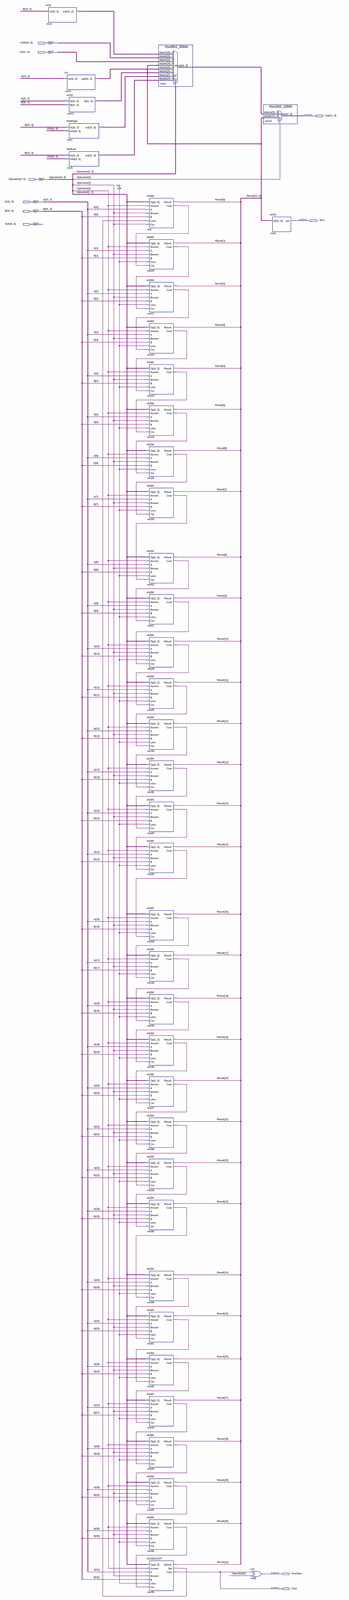
[diagram p0: schematic sheet, whole]
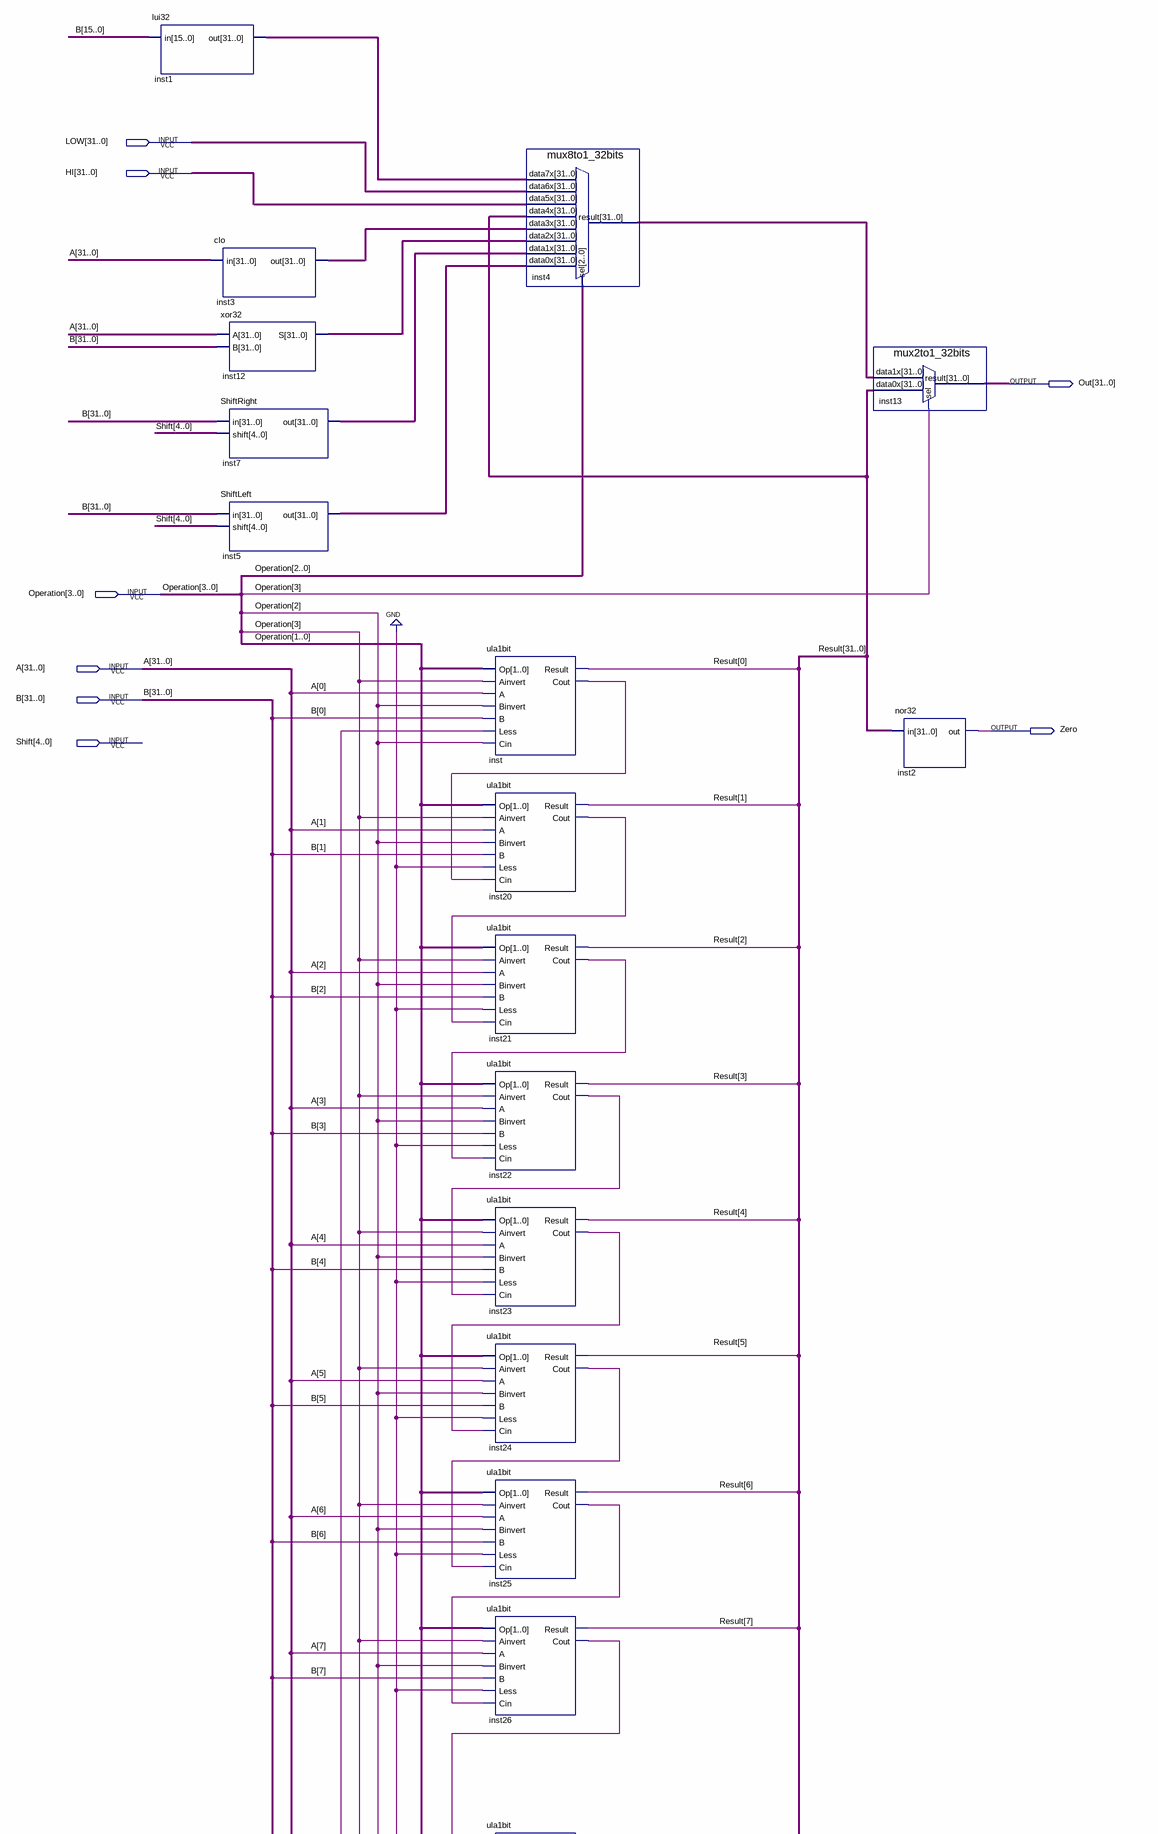
[diagram p1: schematic sheet, upper part]
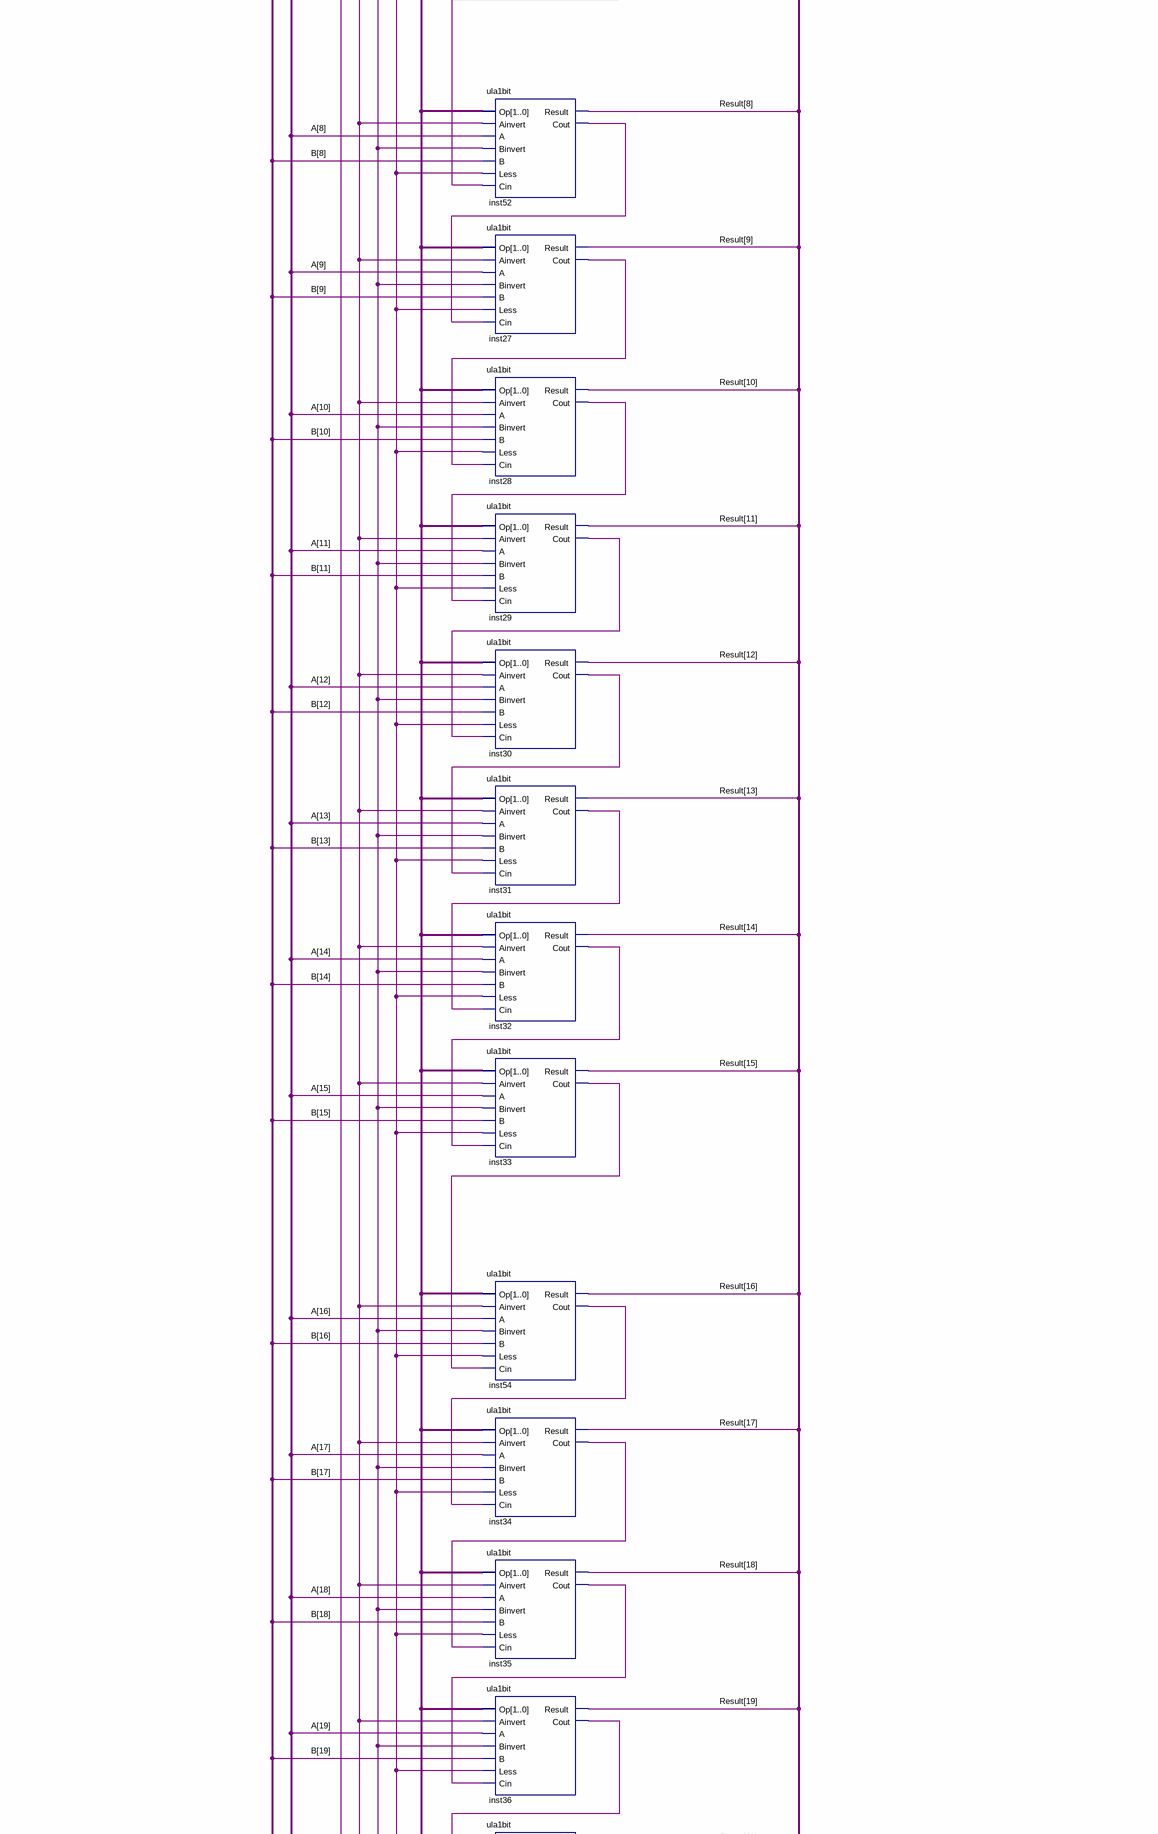
[diagram p2: schematic sheet, middle part]
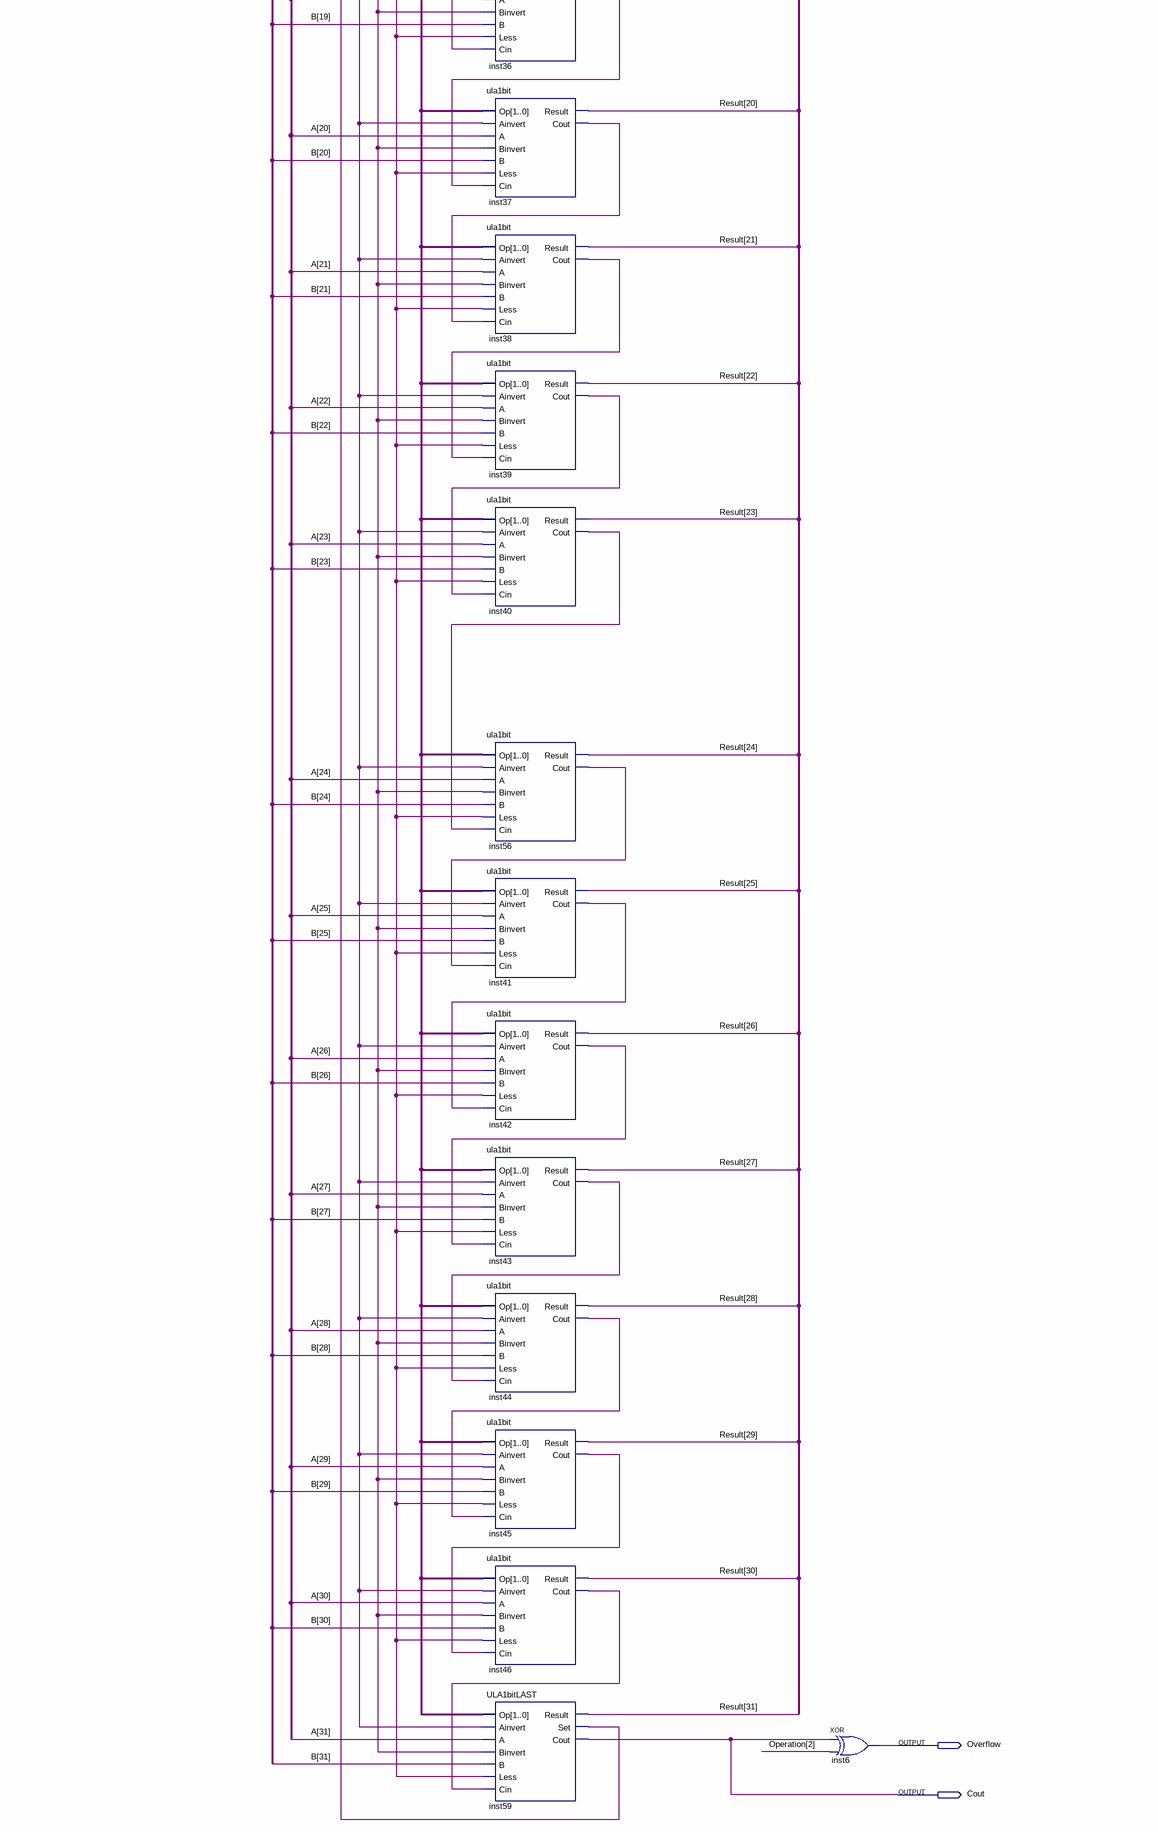
[diagram p3: schematic sheet, lower part]
// Quartus schematic ULA.bdf as structural Verilog: 41 symbols, 10 pins
module ULA (
  input  [31:0] LOW,
  input  [31:0] HI,
  input  [3:0] Operation,
  input  [31:0] A,
  input  [31:0] B,
  input  [4:0] Shift,
  output [31:0] Out,
  output Zero,
  output Overflow,
  output Cout
);

  wire inst20_cout, inst21_cout, inst22_cout, inst23_cout, inst24_cout, inst25_cout, inst26_cout,
       inst27_cout, inst28_cout, inst29_cout, inst30_cout, inst31_cout, inst32_cout, inst33_cout,
       inst34_cout, inst35_cout, inst36_cout, inst37_cout, inst38_cout, inst39_cout, inst40_cout,
       inst41_cout, inst42_cout, inst43_cout, inst44_cout, inst45_cout, inst46_cout, inst52_cout,
       inst54_cout, inst56_cout, inst59_set, inst_cout;
  wire [31:0] inst1_out, inst3_out, inst4_result, inst5_out, inst7_out, inst12_s, Result;

  lui32 inst1 (.in(B[15:0]), .out(inst1_out));
  clo inst3 (.in(A), .out(inst3_out));
  xor32 inst12 (.A(A), .B(B), .S(inst12_s));
  ShiftRight inst7 (.in(B), .shift(Shift), .out(inst7_out));
  ShiftLeft inst5 (.in(B), .shift(Shift), .out(inst5_out));
  ula1bit inst (
    .Op(Operation[1:0]), .Ainvert(Operation[3]), .A(A[0]), .Binvert(Operation[2]), .B(B[0]),
    .Less(inst59_set), .Cin(Operation[2]), .Result(Result[0]), .Cout(inst_cout));
  ula1bit inst20 (
    .Op(Operation[1:0]), .Ainvert(Operation[3]), .A(A[1]), .Binvert(Operation[2]), .B(B[1]), .Less(1'b0),
    .Cin(inst_cout), .Result(Result[1]), .Cout(inst20_cout));
  ula1bit inst21 (
    .Op(Operation[1:0]), .Ainvert(Operation[3]), .A(A[2]), .Binvert(Operation[2]), .B(B[2]), .Less(1'b0),
    .Cin(inst20_cout), .Result(Result[2]), .Cout(inst21_cout));
  ula1bit inst22 (
    .Op(Operation[1:0]), .Ainvert(Operation[3]), .A(A[3]), .Binvert(Operation[2]), .B(B[3]), .Less(1'b0),
    .Cin(inst21_cout), .Result(Result[3]), .Cout(inst22_cout));
  ula1bit inst23 (
    .Op(Operation[1:0]), .Ainvert(Operation[3]), .A(A[4]), .Binvert(Operation[2]), .B(B[4]), .Less(1'b0),
    .Cin(inst22_cout), .Result(Result[4]), .Cout(inst23_cout));
  ula1bit inst24 (
    .Op(Operation[1:0]), .Ainvert(Operation[3]), .A(A[5]), .Binvert(Operation[2]), .B(B[5]), .Less(1'b0),
    .Cin(inst23_cout), .Result(Result[5]), .Cout(inst24_cout));
  ula1bit inst25 (
    .Op(Operation[1:0]), .Ainvert(Operation[3]), .A(A[6]), .Binvert(Operation[2]), .B(B[6]), .Less(1'b0),
    .Cin(inst24_cout), .Result(Result[6]), .Cout(inst25_cout));
  ula1bit inst26 (
    .Op(Operation[1:0]), .Ainvert(Operation[3]), .A(A[7]), .Binvert(Operation[2]), .B(B[7]), .Less(1'b0),
    .Cin(inst25_cout), .Result(Result[7]), .Cout(inst26_cout));
  ula1bit inst52 (
    .Op(Operation[1:0]), .Ainvert(Operation[3]), .A(A[8]), .Binvert(Operation[2]), .B(B[8]), .Less(1'b0),
    .Cin(inst26_cout), .Result(Result[8]), .Cout(inst52_cout));
  ula1bit inst27 (
    .Op(Operation[1:0]), .Ainvert(Operation[3]), .A(A[9]), .Binvert(Operation[2]), .B(B[9]), .Less(1'b0),
    .Cin(inst52_cout), .Result(Result[9]), .Cout(inst27_cout));
  ula1bit inst28 (
    .Op(Operation[1:0]), .Ainvert(Operation[3]), .A(A[10]), .Binvert(Operation[2]), .B(B[10]), .Less(1'b0),
    .Cin(inst27_cout), .Result(Result[10]), .Cout(inst28_cout));
  ula1bit inst29 (
    .Op(Operation[1:0]), .Ainvert(Operation[3]), .A(A[11]), .Binvert(Operation[2]), .B(B[11]), .Less(1'b0),
    .Cin(inst28_cout), .Result(Result[11]), .Cout(inst29_cout));
  ula1bit inst30 (
    .Op(Operation[1:0]), .Ainvert(Operation[3]), .A(A[12]), .Binvert(Operation[2]), .B(B[12]), .Less(1'b0),
    .Cin(inst29_cout), .Result(Result[12]), .Cout(inst30_cout));
  ula1bit inst31 (
    .Op(Operation[1:0]), .Ainvert(Operation[3]), .A(A[13]), .Binvert(Operation[2]), .B(B[13]), .Less(1'b0),
    .Cin(inst30_cout), .Result(Result[13]), .Cout(inst31_cout));
  ula1bit inst32 (
    .Op(Operation[1:0]), .Ainvert(Operation[3]), .A(A[14]), .Binvert(Operation[2]), .B(B[14]), .Less(1'b0),
    .Cin(inst31_cout), .Result(Result[14]), .Cout(inst32_cout));
  ula1bit inst33 (
    .Op(Operation[1:0]), .Ainvert(Operation[3]), .A(A[15]), .Binvert(Operation[2]), .B(B[15]), .Less(1'b0),
    .Cin(inst32_cout), .Result(Result[15]), .Cout(inst33_cout));
  ula1bit inst54 (
    .Op(Operation[1:0]), .Ainvert(Operation[3]), .A(A[16]), .Binvert(Operation[2]), .B(B[16]), .Less(1'b0),
    .Cin(inst33_cout), .Result(Result[16]), .Cout(inst54_cout));
  ula1bit inst34 (
    .Op(Operation[1:0]), .Ainvert(Operation[3]), .A(A[17]), .Binvert(Operation[2]), .B(B[17]), .Less(1'b0),
    .Cin(inst54_cout), .Result(Result[17]), .Cout(inst34_cout));
  ula1bit inst35 (
    .Op(Operation[1:0]), .Ainvert(Operation[3]), .A(A[18]), .Binvert(Operation[2]), .B(B[18]), .Less(1'b0),
    .Cin(inst34_cout), .Result(Result[18]), .Cout(inst35_cout));
  ula1bit inst36 (
    .Op(Operation[1:0]), .Ainvert(Operation[3]), .A(A[19]), .Binvert(Operation[2]), .B(B[19]), .Less(1'b0),
    .Cin(inst35_cout), .Result(Result[19]), .Cout(inst36_cout));
  ula1bit inst37 (
    .Op(Operation[1:0]), .Ainvert(Operation[3]), .A(A[20]), .Binvert(Operation[2]), .B(B[20]), .Less(1'b0),
    .Cin(inst36_cout), .Result(Result[20]), .Cout(inst37_cout));
  ula1bit inst38 (
    .Op(Operation[1:0]), .Ainvert(Operation[3]), .A(A[21]), .Binvert(Operation[2]), .B(B[21]), .Less(1'b0),
    .Cin(inst37_cout), .Result(Result[21]), .Cout(inst38_cout));
  ula1bit inst39 (
    .Op(Operation[1:0]), .Ainvert(Operation[3]), .A(A[22]), .Binvert(Operation[2]), .B(B[22]), .Less(1'b0),
    .Cin(inst38_cout), .Result(Result[22]), .Cout(inst39_cout));
  ula1bit inst40 (
    .Op(Operation[1:0]), .Ainvert(Operation[3]), .A(A[23]), .Binvert(Operation[2]), .B(B[23]), .Less(1'b0),
    .Cin(inst39_cout), .Result(Result[23]), .Cout(inst40_cout));
  ula1bit inst56 (
    .Op(Operation[1:0]), .Ainvert(Operation[3]), .A(A[24]), .Binvert(Operation[2]), .B(B[24]), .Less(1'b0),
    .Cin(inst40_cout), .Result(Result[24]), .Cout(inst56_cout));
  ula1bit inst41 (
    .Op(Operation[1:0]), .Ainvert(Operation[3]), .A(A[25]), .Binvert(Operation[2]), .B(B[25]), .Less(1'b0),
    .Cin(inst56_cout), .Result(Result[25]), .Cout(inst41_cout));
  ula1bit inst42 (
    .Op(Operation[1:0]), .Ainvert(Operation[3]), .A(A[26]), .Binvert(Operation[2]), .B(B[26]), .Less(1'b0),
    .Cin(inst41_cout), .Result(Result[26]), .Cout(inst42_cout));
  ula1bit inst43 (
    .Op(Operation[1:0]), .Ainvert(Operation[3]), .A(A[27]), .Binvert(Operation[2]), .B(B[27]), .Less(1'b0),
    .Cin(inst42_cout), .Result(Result[27]), .Cout(inst43_cout));
  ula1bit inst44 (
    .Op(Operation[1:0]), .Ainvert(Operation[3]), .A(A[28]), .Binvert(Operation[2]), .B(B[28]), .Less(1'b0),
    .Cin(inst43_cout), .Result(Result[28]), .Cout(inst44_cout));
  ula1bit inst45 (
    .Op(Operation[1:0]), .Ainvert(Operation[3]), .A(A[29]), .Binvert(Operation[2]), .B(B[29]), .Less(1'b0),
    .Cin(inst44_cout), .Result(Result[29]), .Cout(inst45_cout));
  ula1bit inst46 (
    .Op(Operation[1:0]), .Ainvert(Operation[3]), .A(A[30]), .Binvert(Operation[2]), .B(B[30]), .Less(1'b0),
    .Cin(inst45_cout), .Result(Result[30]), .Cout(inst46_cout));
  ULA1bitLAST inst59 (
    .Op(Operation[1:0]), .Ainvert(Operation[3]), .A(A[31]), .Binvert(Operation[2]), .B(B[31]), .Less(1'b0),
    .Cin(inst46_cout), .Result(Result[31]), .Set(inst59_set), .Cout(Cout));
  mux8to1_32bits inst4 (
    .data7x(inst1_out), .data6x(LOW), .data5x(HI), .data4x(Result), .data3x(inst3_out), .data2x(inst12_s),
    .data1x(inst7_out), .data0x(inst5_out), .sel(Operation[2:0]), .result(inst4_result));
  xor inst6 (Overflow, Cout, Operation[2]);
  mux2to1_32bits inst13 (.data1x(inst4_result), .data0x(Result), .sel(Operation[3]), .result(Out));
  nor32 inst2 (.in(Result), .out(Zero));
endmodule
